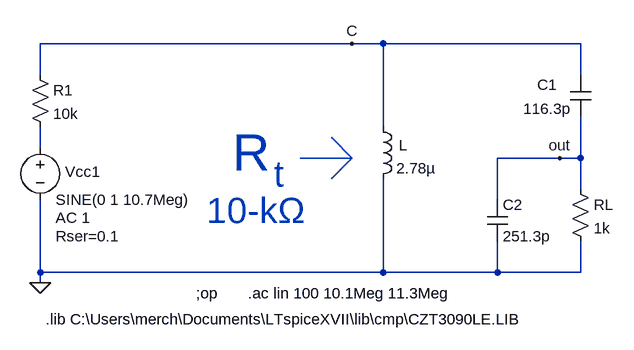
[diagram p0: schematic example 3-6_2.asc]
example 3-6_2.asc, the LTspice schematic file:
Version 4
SHEET 1 2688 680
WIRE 240 -48 -240 -48
WIRE 288 -48 240 -48
WIRE 592 -48 288 -48
WIRE -240 0 -240 -48
WIRE 592 0 592 -48
WIRE 288 80 288 -48
WIRE -240 112 -240 80
WIRE 560 128 464 128
WIRE 592 128 592 64
WIRE 592 128 560 128
WIRE 592 176 592 128
WIRE 464 192 464 128
WIRE -240 304 -240 192
WIRE 288 304 288 160
WIRE 288 304 -240 304
WIRE 464 304 464 256
WIRE 464 304 288 304
WIRE 592 304 592 256
WIRE 592 304 464 304
WIRE -240 320 -240 304
FLAG -240 320 0
FLAG 560 128 out
FLAG 240 -48 C
SYMBOL ind 272 64 R0
WINDOW 0 40 44 Left 2
SYMATTR InstName L
SYMATTR Value 2.78µ
SYMATTR SpiceLine Ipk=120 Rser=0.0 Cpar=0
SYMBOL res 576 160 R0
SYMATTR InstName RL
SYMATTR Value 1k
SYMBOL voltage -240 96 R0
WINDOW 123 24 124 Left 2
WINDOW 39 24 152 Left 2
WINDOW 0 38 53 Left 2
SYMATTR Value2 AC 1
SYMATTR SpiceLine Rser=0.1
SYMATTR InstName Vcc1
SYMATTR Value SINE(0 1 10.7Meg)
SYMBOL res -256 -16 R0
SYMATTR InstName R1
SYMATTR Value 10k
SYMBOL cap 448 192 R0
SYMATTR InstName C2
SYMATTR Value 251.3p
SYMBOL cap 576 0 R0
WINDOW 0 -51 15 Left 2
WINDOW 3 -72 52 Left 2
SYMATTR InstName C1
SYMATTR Value 116.3p
TEXT -232 376 Left 2 !.lib C:\\Users\\merch\\Documents\\LTspiceXVII\\lib\\cmp\\CZT3090LE.LIB
TEXT 0 336 Left 2 !;op
TEXT 80 336 Left 2 !.ac lin 100 10.1Meg 11.3Meg
TEXT 56 120 Left 6 ;R
TEXT 120 152 Left 5 ;t
TEXT 16 208 Left 5 ;10-kΩ
LINE Normal 240 128 160 128
LINE Normal 240 128 208 96
LINE Normal 240 128 240 128 2
LINE Normal 208 160 240 128

The netlist it stands for:
* example 3-6_2.asc
L C 0 2.78µ Ipk=120 Rser=0.0 Cpar=0
RL out 0 1k
Vcc1 N001 0 SINE(0 1 10.7Meg) AC 1 Rser=0.1
R1 C N001 10k
C2 out 0 251.3p
C1 C out 116.3p
.lib C:\Users\merch\Documents\LTspiceXVII\lib\cmp\CZT3090LE.LIB
;op
.ac lin 100 10.1Meg 11.3Meg
* R
* t
* 10-kΩ
.backanno
.end

* Results of the author's LTspice run, read from the files saved beside the schematic
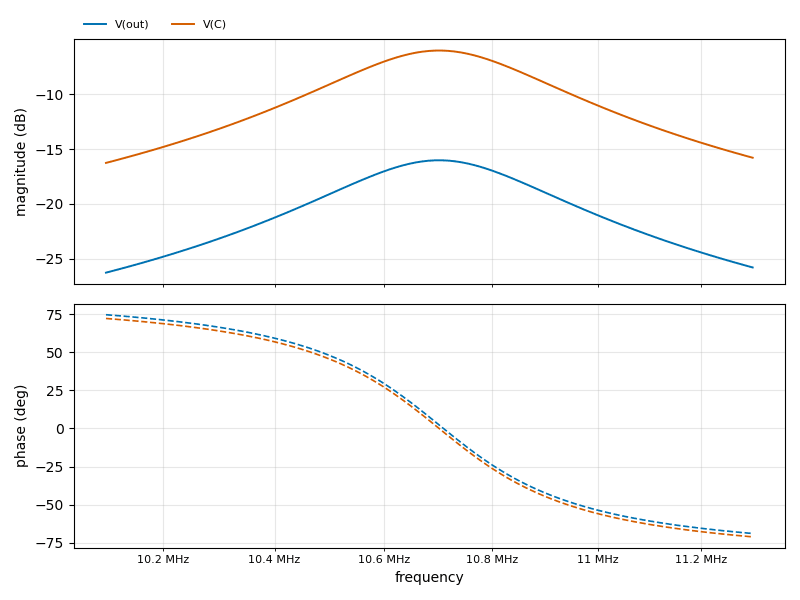
[diagram p1: AC Analysis of example 3-6_2.asc, plotted from the saved traces]
* AC Analysis, 1 run:
*   V(out): -26.26 dB at 10.1 MHz, -25.79 dB at 11.3 MHz, peak -16.02 dB at 10.71 MHz, 3 dB below the peak at 10.5 MHz and 10.9 MHz
*   V(C): -16.26 dB at 10.1 MHz, -15.79 dB at 11.3 MHz, peak -6.02 dB at 10.71 MHz, 3 dB below the peak at 10.5 MHz and 10.9 MHz